# EAGLE schematic Schematic (EAGLE 6.5.0)
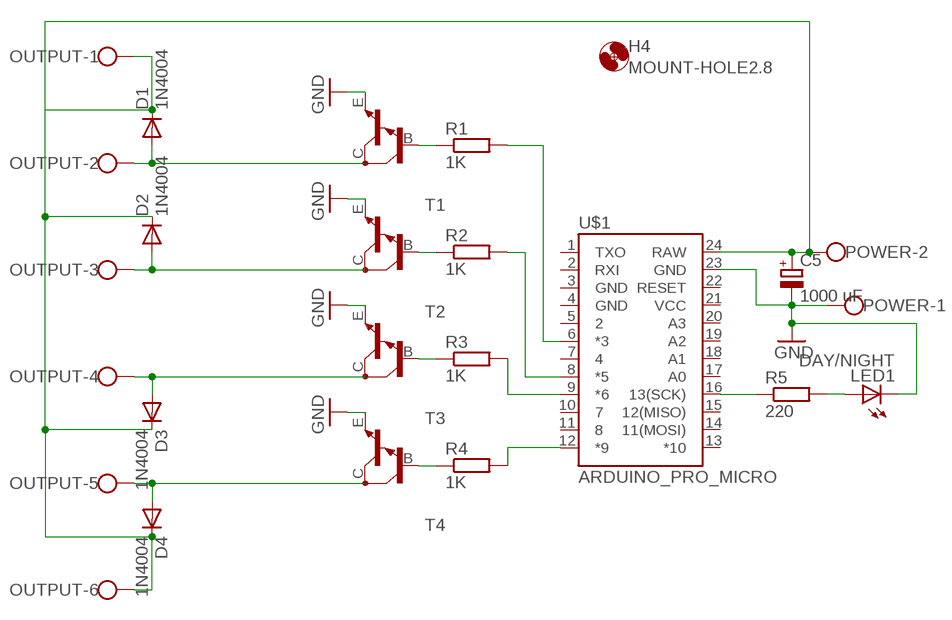
[diagram p0: schematic, sheet 1]

## Parts
C5  1000 uF  CPOL-EUE5-13  [E5-13]
D1  1N4004  [DO41-10]
D2  1N4004  [DO41-10]
D3  1N4004  [DO41-10]
D4  1N4004  [DO41-10]
H4  MOUNT-HOLE2.8  [2,8]
LED1  DAY/NIGHT  LED3MM  [LED3MM]
OUTPUT  W237-136  [W237-136]
POWER  W237-102  [W237-102]
R1  1K  R-EU_0207/10  [0207/10]
R2  1K  R-EU_0207/10  [0207/10]
R3  1K  R-EU_0207/10  [0207/10]
R4  1K  R-EU_0207/10  [0207/10]
R5  220  R-EU_0204/7  [0204/7]
T1  TIP122VERTICAL  [TO220AV]
T2  TIP122VERTICAL  [TO220AV]
T3  TIP122VERTICAL  [TO220AV]
T4  TIP122VERTICAL  [TO220AV]
U$1  ARDUINO_PRO_MICRO  [ARDUINO_PRO_MICRO]

## Nets
GND: C5.- LED1.K(C) POWER.1 T1.E T2.E T3.E T4.E U$1.23(GND)
N$1: LED1.A R5.2
N$2: R4.1 T4.B
N$3: C5.+ D1.C D2.C D3.C D4.C OUTPUT.1 OUTPUT.6 POWER.2 U$1.24(RAW)
N$4: D4.A OUTPUT.5 T4.C
N$5: R4.2 U$1.12(*9)
N$6: R3.2 U$1.9(*6)
N$9: D1.A OUTPUT.2 T1.C
N$10: R3.1 T3.B
N$11: R2.1 T2.B
N$12: R1.1 T1.B
N$13: R5.1 U$1.16(13(SCK))
N$14: D3.A OUTPUT.4 T3.C
N$15: R2.2 U$1.8(*5)
N$16: R1.2 U$1.6(*3)
N$17: D2.A OUTPUT.3 T2.C
Unconnected: U$1.1(TXO) U$1.2(RXI) U$1.3(GND) U$1.4(GND) U$1.5 U$1.7 U$1.10 U$1.11 U$1.13(*10) U$1.14(11(MOSI)) U$1.15(12(MISO)) U$1.17(A0) U$1.18(A1) U$1.19(A2) U$1.20(A3) U$1.21(VCC) U$1.22(RESET)

## Library data of the parts
C5 = rcl:CPOL-EU: POLARIZED CAPACITOR, European symbol
D1-D4 = diode:1N4004: DIODE general purpose rectifier, 1 A
H4 = holes:MOUNT-HOLE: MOUNTING HOLE with drill center marker
LED1 = SparkFun-LED:LED: LEDs Standard schematic elements and footprints for 5mm, 3mm, 1206, and 0603 sized LEDs. 5mm - Spark Fun Electronics SKU : COM-00529 (and others)
OUTPUT = con-wago-500:W237-136: WAGO SCREW CLAMP; MPN: 237-136; OC_FARNELL: unknown; OC_NEWARK: 84K9151
POWER = con-wago-500:W237-102: WAGO SCREW CLAMP; MPN: 237-102; OC_FARNELL: unknown; OC_NEWARK: 70K9898
R1-R4 = rcl:R-EU_: RESISTOR, European symbol
R5 = resistor:R-EU_: RESISTOR, European symbol
T1-T4 = transistor:TIP122: NPN BIPOLAR DARLINGTON TRANSISTOR
U$1 = SparkFun-Boards:ARDUINO_PRO_MICRO